# Altium schematic sheet I2C Network.SchDoc: I2C Network Block Diagram
size A3; DocumentNumber: 49; SheetNumber: 49; SheetTotal: 54
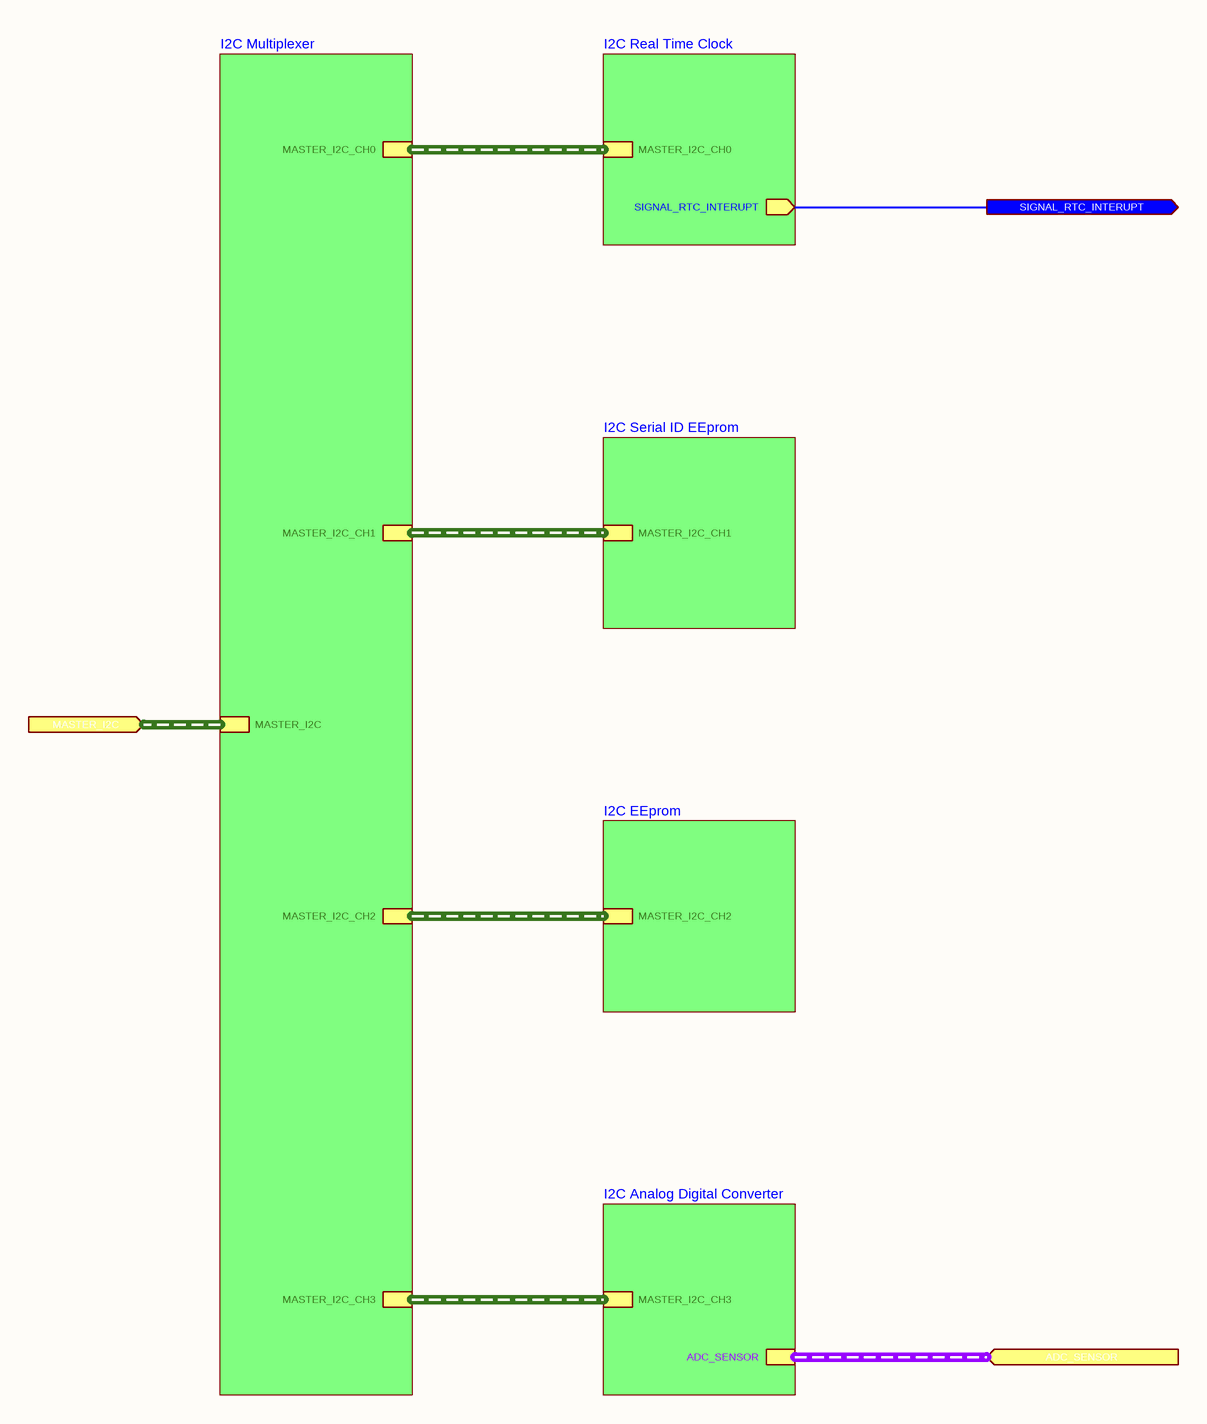
[diagram p0: I2C Network.SchDoc]

## Sub-sheets
I2C Analog Digital Converter = Analog Digital Converter.SchDoc: MASTER_I2C_CH3 (harness MASTER_I2C_CH3), ADC_SENSOR (harness ADC_SENSOR)
I2C EEprom = EEPROM.SchDoc: MASTER_I2C_CH2 (harness MASTER_I2C_CH2)
I2C Multiplexer = I2C Multiplexer.SchDoc: MASTER_I2C_CH1 (harness MASTER_I2C_CH1), MASTER_I2C_CH2 (harness MASTER_I2C_CH2), MASTER_I2C_CH3 (harness MASTER_I2C_CH3), MASTER_I2C_CH0 (harness MASTER_I2C_CH0), MASTER_I2C (harness MASTER_I2C)
I2C Real Time Clock = Real Time Clock.SchDoc: SIGNAL_RTC_INTERUPT (out), MASTER_I2C_CH0 (harness MASTER_I2C_CH0)
I2C Serial ID EEprom = Serial ID EEPROM.SchDoc: MASTER_I2C_CH1 (harness MASTER_I2C_CH1)

## Ports
ADC_SENSOR (in, harness ADC_SENSOR), MASTER_I2C (in, harness MASTER_I2C), SIGNAL_RTC_INTERUPT (out)

## Nets
SIGNAL_RTC_INTERUPT: port SIGNAL_RTC_INTERUPT, sheet I2C Real Time Clock/SIGNAL_RTC_INTERUPT

## Buses and harness runs
harness port ADC_SENSOR = sheet I2C Analog Digital Converter/ADC_SENSOR
harness port MASTER_I2C = sheet I2C Multiplexer/MASTER_I2C
harness sheet I2C Analog Digital Converter/MASTER_I2C_CH3 = sheet I2C Multiplexer/MASTER_I2C_CH3
harness sheet I2C EEprom/MASTER_I2C_CH2 = sheet I2C Multiplexer/MASTER_I2C_CH2
harness sheet I2C Multiplexer/MASTER_I2C_CH0 = sheet I2C Real Time Clock/MASTER_I2C_CH0
harness sheet I2C Multiplexer/MASTER_I2C_CH1 = sheet I2C Serial ID EEprom/MASTER_I2C_CH1

## Notes on the sheet
- Engineer
- All Rights are reserved to Customer and Engineer. [2021]
- Size:
- Date:
- A3
- Project :
- Time:
- Sheet
- of
- Customer
- Product ID
- Module ID
- Version
- File:
- Revision